# Altium schematic sheet Debug and Reset.SchDoc: Motor Vibration
size A4; Organization: NTUST EE-305; Address1: No.43, Sec. 4, Keelung Rd.; Address2: Da’an Dist.; Address3: Taipei 106; Address4: Taiwan (R.O.C.); DocumentNumber: 1; Revision: 3.0; SheetNumber: 3; SheetTotal: 9
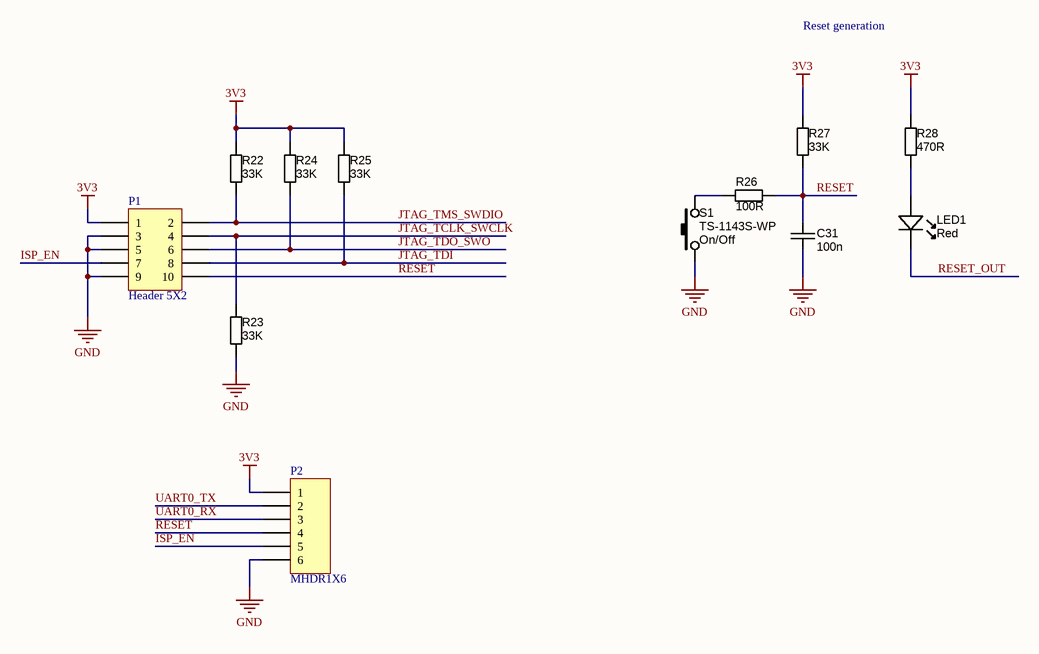
[diagram p0: Debug and Reset.SchDoc]

## Parts
C31  100n  [CAPC1005N]
LED1  Red  [LED-0603-RED]
P1  Header 5X2  [Header 5x2 1.27mm]
P2  MHDR1X6  [MHDR1X6]
R22  33K  [RESC1005N]
R23  33K  [RESC1005N]
R24  33K  [RESC1005N]
R25  33K  [RESC1005N]
R26  100R  [RESC1005N]
R27  33K  [RESC1005N]
R28  470R  [RESC1005N]
S1  TS-1143S-WP  Function: On/Off  [TS-1143S]

## Nets
3V3: P1.1 P2.1 R22.1 R24.1 R25.1 R27.1 R28.1
GND: C31.2 P1.3 P1.5 P1.9 P2.6 R23.2 S1.1
ISP_EN: P1.7 P2.5
JTAG_TCLK_SWCLK: P1.4 R23.1
JTAG_TDI: P1.8 R25.2
JTAG_TDO_SWO: P1.6 R24.2
JTAG_TMS_SWDIO: P1.2 R22.2
RESET: C31.1 P1.10 P2.4 R26.2 R27.2
RESET_OUT: LED1.K
UART0_RX: P2.3
UART0_TX: P2.2
NetLED1_A: LED1.A R28.2
NetR26_1: R26.1 S1.2

## Notes on the sheet
- Reset generation
- Title
- Name
- Size:
- Revision:
- A4
- Date:
- Time:
- Sheet
- of

## Library data of the parts
C31 = Capacitor SMD Cer X7R: Manufacturer 1: Kemet; Manufacturer Part Number 1: C0805C104K5RACTU; Tolerance: ?0%; Ratings: 50V; X7R; Material: ceramic; Package / Case: 0805 (2012 metric); Supplier 1: Digi-Key; Supplier Part Number 1: 399-1170-1-ND; Value: 100n
LED1 = LED_SMD_Red_0805: LED, 0805 SMD, Red; Manufacturer 1: Ligitek; Manufacturer Part Number 1: LG170SR-CT; Material: GaAIAs; Ratings: 20 mcd; 643 nm; Package / Case: 0805
P1 = Header 5X2: Header, 5-Pin, Dual row; LatestRevisionDate: 17-Jul-2002; LatestRevisionNote: Re-released for DXP Platform.; Publisher: Altium Limited
P2 = MHDR1X6: Header, 6-Pin; LatestRevisionDate: 17-Jul-2002; LatestRevisionNote: Re-released for DXP Platform.; Publisher: Altium Limited
R22-R28 = Resistor SMD chip: Manufacturer 1: Yageo; Manufacturer Part Number 1: RC0805JR-0710KL; Ratings: 1/8 W; Tolerance: ?%; Package / Case: 0805 (2012 metric); Material: Thick Film; Supplier 1: Digi-Key; Supplier Part Number 1: 311-10KARCT-ND
  R22-R25 R27: Value: 33K
  R26: Value: 100R
  R28: Value: 470R
S1 = SW_SMD_PB_4.3mm: Switch SMD Tact 4.3mm Stem; Manufacturer 1: Bond-Tact; Manufacturer Part Number 1: TS-1143S-WP-200; Package / Case: 6.5x6.5mm; 4.3mm stem